# Altium schematic sheet CodeSymExample.SchDoc
size A3
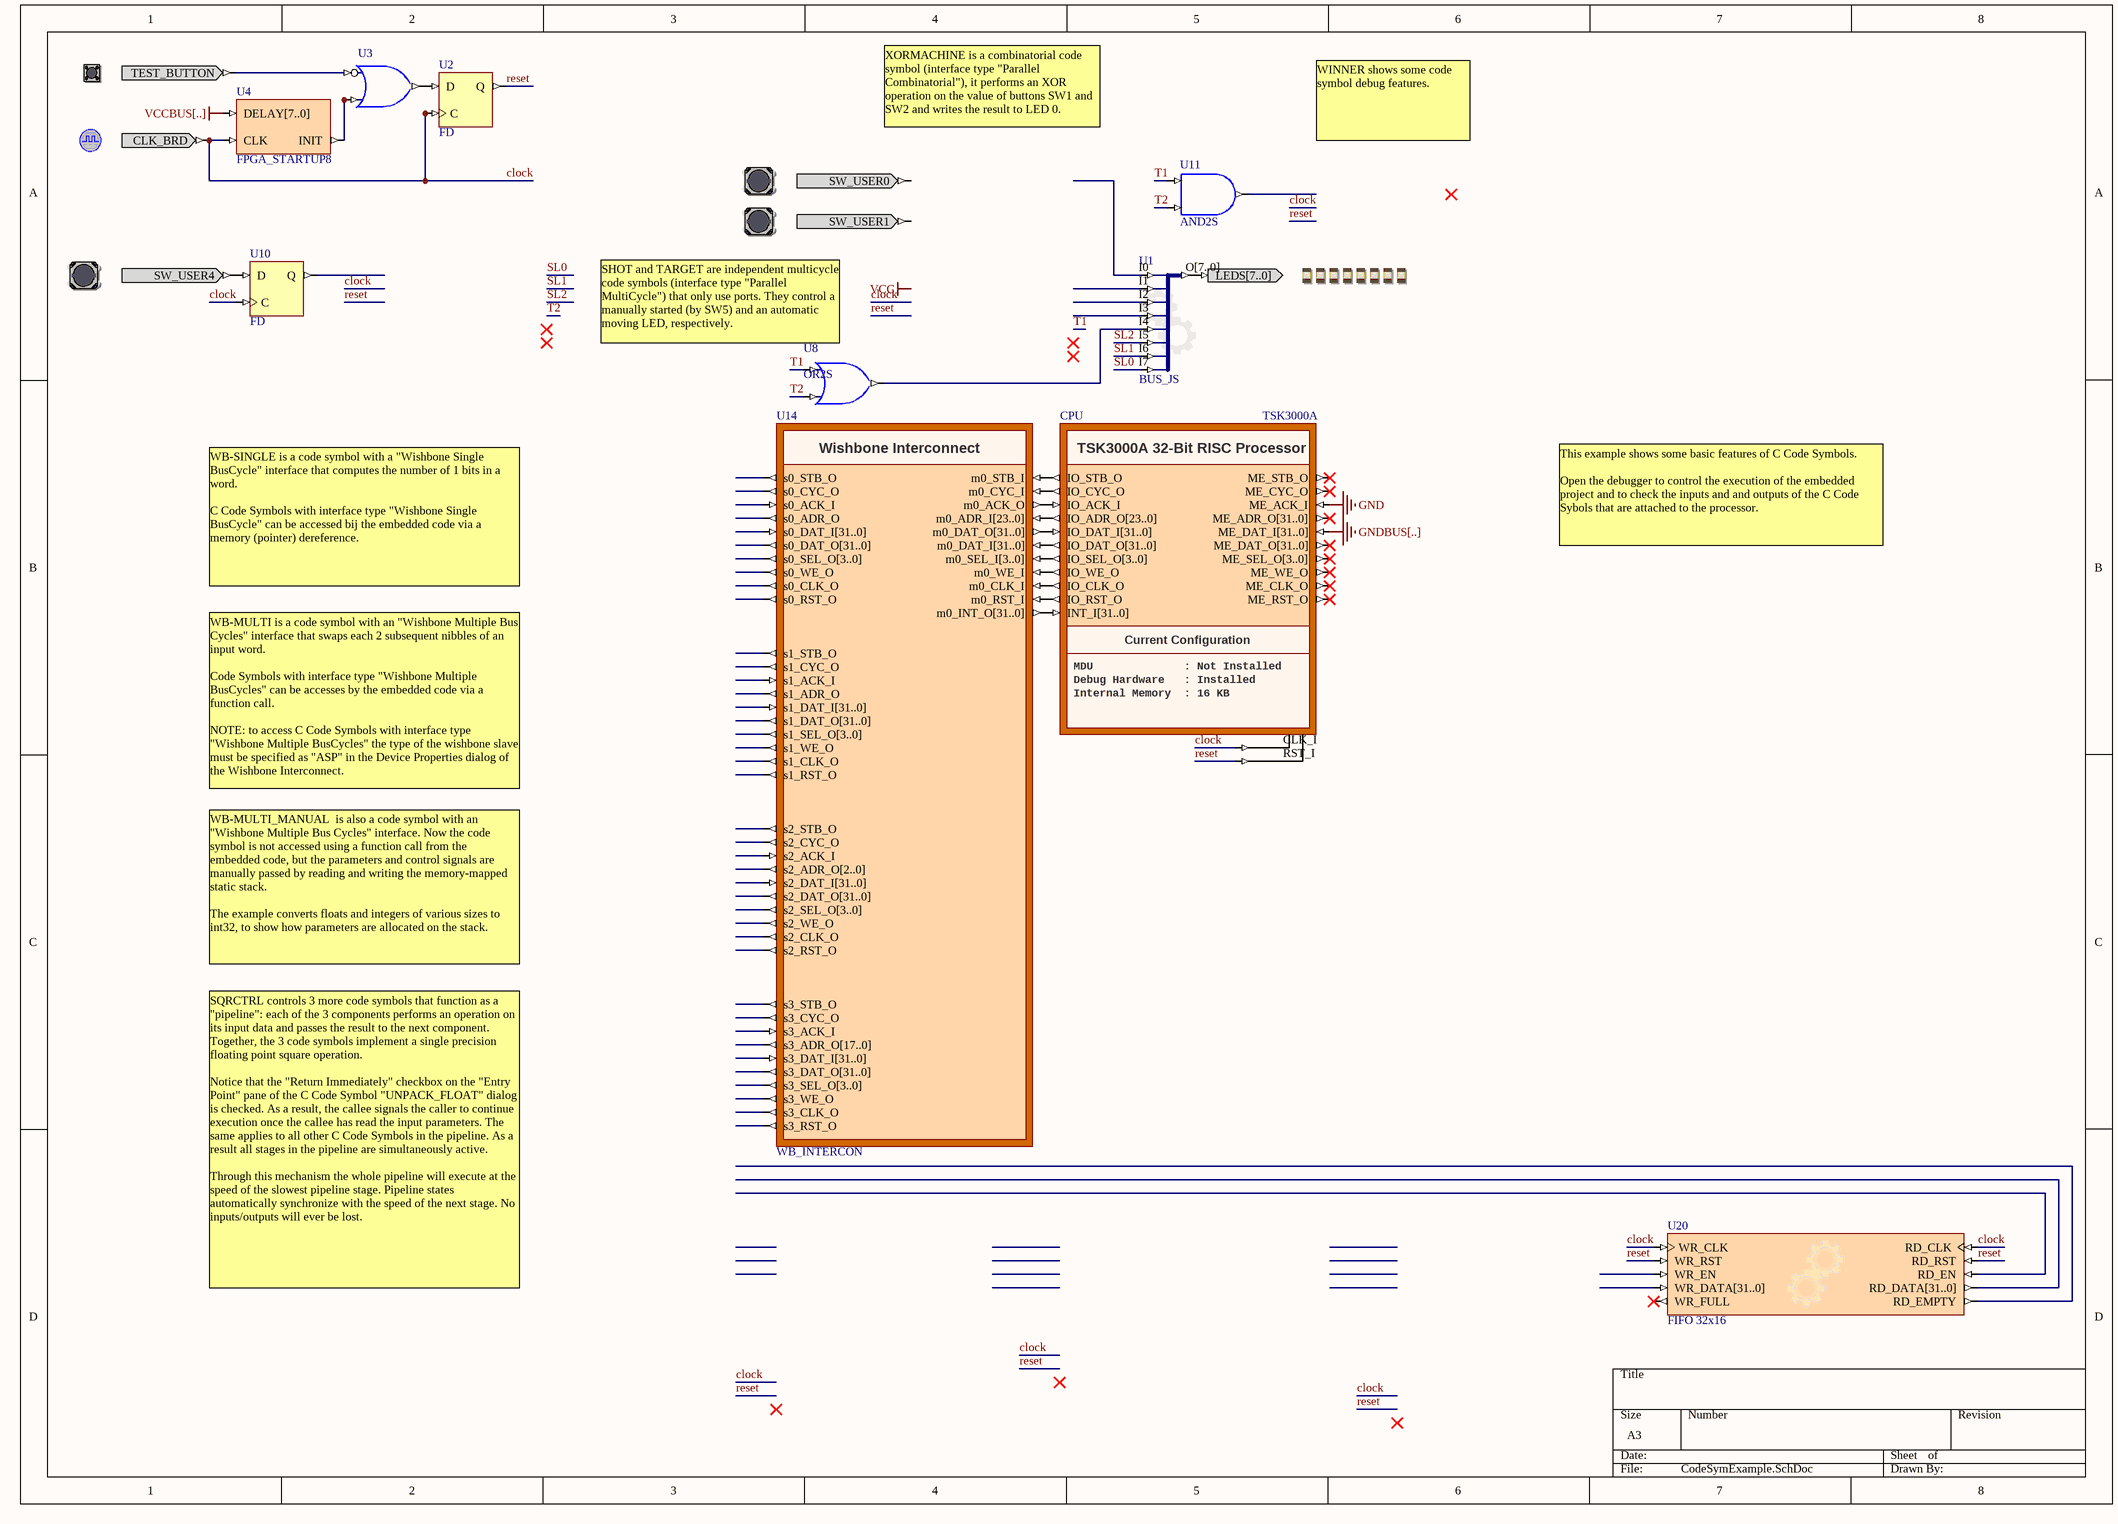
[diagram p0: CodeSymExample.SchDoc]

## Parts
(Parts that share a designator on the sheet are numbered #1, #2 ... from top to bottom, then left to right.)
?#1  TEST_BUTTON  (value not drawn)
?#2  CLOCK_BOARD  (value not drawn)
?#3  USER_BUTTON0  (value not drawn)
?#4  USER_BUTTON1  (value not drawn)
?#5  USER_BUTTON4  (value not drawn)
?#6  LED  (value not drawn)
CPU  TSK3000A
U1  BUS_JS
U2  FD
U3  OR2N1S  (value not drawn)
U4  FPGA_STARTUP8
U8  OR2S
U10  FD
U11  AND2S
U14  WB_INTERCON
U20  FIFO 32x16

## Nets
GND: CPU.ME_ACK_I
GNDBUS[..]: CPU.ME_DAT_I[31..0]
VCCBUS[..]: U4.DELAY[7..0]
clock: ?#2.CLK_BRD CPU.CLK_I U2.C U4.CLK U10.C U20.RD_CLK U20.WR_CLK
reset: CPU.RST_I U2.Q U20.RD_RST U20.WR_RST
SL0: U1.I7
SL1: U1.I6
SL2: U1.I5
T1: U8.I0 U11.I0
T2: U8.I1 U11.I1
Net?#1_TEST_BUTTON: ?#1.TEST_BUTTON U3.I0
Net?#5_SW_USER4: ?#5.SW_USER4 U10.D
Net?#6_LEDS[7..0]: ?#6.LEDS[7..0] U1.O[7..0]
NetCPU_INT_I[31..0]: CPU.INT_I[31..0] U14.m0_INT_O[31..0]
NetCPU_IO_ACK_I: CPU.IO_ACK_I U14.m0_ACK_O
NetCPU_IO_ADR_O[23..0]: CPU.IO_ADR_O[23..0] U14.m0_ADR_I[23..0]
NetCPU_IO_CLK_O: CPU.IO_CLK_O U14.m0_CLK_I
NetCPU_IO_CYC_O: CPU.IO_CYC_O U14.m0_CYC_I
NetCPU_IO_DAT_I[31..0]: CPU.IO_DAT_I[31..0] U14.m0_DAT_O[31..0]
NetCPU_IO_DAT_O[31..0]: CPU.IO_DAT_O[31..0] U14.m0_DAT_I[31..0]
NetCPU_IO_RST_O: CPU.IO_RST_O U14.m0_RST_I
NetCPU_IO_SEL_O[3..0]: CPU.IO_SEL_O[3..0] U14.m0_SEL_I[3..0]
NetCPU_IO_STB_O: CPU.IO_STB_O U14.m0_STB_I
NetCPU_IO_WE_O: CPU.IO_WE_O U14.m0_WE_I
NetU1_I4: U1.I4 U8.O
NetU2_D: U2.D U3.O
NetU3_I1: U3.I1 U4.INIT

Not connected (* = marked no-connect by the designer): ?#3 SW_USER0; ?#4 SW_USER1; CPU ME_ADR_O[31..0]* ME_CLK_O* ME_CYC_O* ME_DAT_O[31..0]* ME_RST_O* ME_SEL_O[3..0]* ME_STB_O* ME_WE_O*; U1 I0 I1 I2 I3; U10 Q; U11 O; U14 s0_ACK_I s0_ADR_O s0_CLK_O s0_CYC_O s0_DAT_I[31..0] s0_DAT_O[31..0] s0_RST_O s0_SEL_O[3..0] s0_STB_O s0_WE_O s1_ACK_I s1_ADR_O s1_CLK_O s1_CYC_O s1_DAT_I[31..0] s1_DAT_O[31..0] s1_RST_O s1_SEL_O[3..0] s1_STB_O s1_WE_O s2_ACK_I s2_ADR_O[2..0] s2_CLK_O s2_CYC_O s2_DAT_I[31..0] s2_DAT_O[31..0] s2_RST_O s2_SEL_O[3..0] s2_STB_O s2_WE_O s3_ACK_I s3_ADR_O[17..0] s3_CLK_O s3_CYC_O s3_DAT_I[31..0] s3_DAT_O[31..0] s3_RST_O s3_SEL_O[3..0] s3_STB_O s3_WE_O; U20 RD_DATA[31..0] RD_EMPTY RD_EN WR_DATA[31..0] WR_EN WR_FULL*

## Notes on the sheet
- XORMACHINE is a combinatorial code symbol (interface type "Parallel Combinatorial"), it performs an XOR operation on the value of buttons SW1 and SW2 and writes the result to LED 0.
- WINNER shows some code symbol debug features.
- (near U8) SHOT and TARGET are independent multicycle code symbols (interface type "Parallel MultiCycle") that only use ports. They control a manually started (by SW5) and an automatic moving LED, respectively.
- WB-SINGLE is a code symbol with a "Wishbone Single BusCycle" interface that computes the number of 1 bits in a word.
  C Code Symbols with interface type "Wishbone Single BusCycle" can be accessed bij the embedded code via a memory (pointer) dereference.
- This example shows some basic features of C Code Symbols.
  Open the debugger to control the execution of the embedded project and to check the inputs and and outputs of the C Code Sybols that are attached to the processor.
- WB-MULTI is a code symbol with an "Wishbone Multiple Bus Cycles" interface that swaps each 2 subsequent nibbles of an input word.
  Code Symbols with interface type "Wishbone Multiple BusCycles" can be accesses by the embedded code via a function call.
  NOTE: to access C Code Symbols with interface type "Wishbone Multiple BusCycles" the type of the wishbone slave must be specified as "ASP" in the Device Properties dialog of the Wishbone Interconnect.
- WB-MULTI_MANUAL  is also a code symbol with an "Wishbone Multiple Bus Cycles" interface. Now the code symbol is not accessed using a function call from the embedded code, but the parameters and control signals are manually passed by reading and writing the memory-mapped static stack.
  The example converts floats and integers of various sizes to int32, to show how parameters are allocated on the stack.
- SQRCTRL controls 3 more code symbols that function as a "pipeline": each of the 3 components performs an operation on its input data and passes the result to the next component. Together, the 3 code symbols implement a single precision floating point square operation.
  Notice that the "Return Immediately" checkbox on the "Entry Point" pane of the C Code Symbol "UNPACK_FLOAT" dialog is checked. As a result, the callee signals the caller to continue execution once the callee has read the input parameters. The same applies to all other C Code Symbols in the pipeline. As a result all stages in the pipeline are simultaneously active.
  Through this mechanism the whole pipeline will execute at the speed of the slowest pipeline stage. Pipeline states automatically synchronize with the speed of the next stage. No inputs/outputs will ever be lost.
- Labels drawn without touching a wire or pin: VCC
- (in symbol TSK3000A) TSK3000A 32-Bit RISC Processor; Current Configuration; MDU              : Not Installed; Debug Hardware   : Installed; Internal Memory  : 16 KB
- (in symbol WB_INTERCON) Wishbone Interconnect

## Library data of the parts
?#1 = TEST_BUTTON: Test / Reset Button; PortComponent: True; Published: 19-Nov-2003; Publisher: Altium Limited; HelpURL: https://wiki.altium.com/display/ADOH/NB2DSK01+-+Daughter+Board+Test-Reset+Button
?#2 = CLOCK_BOARD: Global System Clock Supply; PortComponent: True; Published: 19-Nov-2003; Publisher: Altium Limited; HelpURL: https://wiki.altium.com/display/ADOH/NB2DSK01+-+System+Clocks; UseInDSF: True
?#3 = USER_BUTTON0: Generic User Button; PortComponent: True; Published: 16-Apr-2007; Publisher: Altium Limited; HelpURL: https://wiki.altium.com/display/ADOH/NB2DSK01+-+Generic+User+Switches
?#4 = USER_BUTTON1: Generic User Button; PortComponent: True; Published: 16-Apr-2007; Publisher: Altium Limited; HelpURL: https://wiki.altium.com/display/ADOH/NB2DSK01+-+Generic+User+Switches
?#5 = USER_BUTTON4: Generic User Button; PortComponent: True; Published: 16-Apr-2007; Publisher: Altium Limited; HelpURL: https://wiki.altium.com/display/ADOH/NB2DSK01+-+Generic+User+Switches
?#6 = LED: Bank of eight Red LEDs; PortComponent: True; Published: 19-Nov-2003; Publisher: Altium Limited; HelpURL: https://wiki.altium.com/display/ADOH/NB2DSK01+-+User+LEDs
CPU = TSK3000A: TSK3000A OCD Microprocessor; Nexus_JTAG_Device: True; Nexus_Core: Processor_OCDS; Nexus_JTAG_Order: 0; ConfigurationParameters: {}Version[1.0]{}Option_Processor[0]{}Option_Memory[4]{}Option_MDU[1]{}Option_OCDS[0]{}Option_Shifter[0]{}Option_InterruptCount[32]{}Option_DebugWhenReset[0]{}; ConfiguratorName: FPGA_MCU32; Memory_Configuration: Record[AUTOIMPORT]{}AutoImport_Peripherals[False]{n}Record[CODE_EXPORT]{}ExportType[1]{n}Record[PERIPHERAL]{}ComponentDesignator[sqrctrl]{}Memory_Depth[0x40000]{}Memory_UsageType[peripheral]{}Memory_Speed[1]{}ProgramDownloadAddress[0xFF400000]{}Memory_BusType[TSK3000:addr_bus]{}Memory_Mau[8]{}Memory_MatchedComponent[]{}Memory_Description[U14]{}Memory_FillBitPattern[]{}Memory_IncludeDependencies[False]{}Memory_ByLoadAddress[False]{}Memory_CopyDuringInit[False]{}Memory_NoCopyDuringInit[False]{}Memory_Interrupts[]{n}Record[PERIPHERAL]{}ComponentDesignator[wb_multi]{}Memory_Depth[0x0010]{}Memory_UsageType[asp]{}Memory_Speed[1]{}ProgramDownloadAddress[0xFF200000]{}Memory_BusType[TSK3000:addr_bus]{}Memory_Mau[8]{}Memory_MatchedComponent[]{}Memory_Description[U14]{}Memory_FillBitPattern[]{}Memory_IncludeDependencies[False]{}Memory_ByLoadAddress[False]{}Memory_CopyDuringInit[False]{}Memory_NoCopyDuringInit[False]{}Memory_Interrupts[]{n}Record[PERIPHERAL]{}ComponentDesignator[wb_multi_manual]{}Memory_Depth[0x0010]{}Memory_UsageType[peripheral]{}Memory_Speed[1]{}ProgramDownloadAddress[0xFF300000]{}Memory_BusType[TSK3000:addr_bus]{}Memory_Mau[8]{}Memory_MatchedComponent[]{}Memory_Description[U14]{}Memory_FillBitPattern[]{}Memory_IncludeDependencies[False]{}Memory_ByLoadAddress[False]{}Memory_CopyDuringInit[False]{}Memory_NoCopyDuringInit[False]{}Memory_Interrupts[]{n}Record[PERIPHERAL]{}ComponentDesignator[wb_single]{}Memory_Depth[0x0002]{}Memory_UsageType[peripheral]{}Memory_Speed[1]{}ProgramDownloadAddress[0xFF100000]{}Memory_BusType[TSK3000:addr_bus]{}Memory_Mau[8]{}Memory_MatchedComponent[]{}Memory_Description[U14]{}Memory_FillBitPattern[]{}Memory_IncludeDependencies[False]{}Memory_ByLoadAddress[False]{}Memory_CopyDuringInit[False]{}Memory_NoCopyDuringInit[False]{}Memory_Interrupts[]{n}; ChildModel1: TSK3000A_MCU; ChildModel2: TSK3000A_MDU; ChildModel3: TSK3000A_OCDS; ChildModel4: TSK3000A_Shift_Barrel; ChildModel5: TSK3000A_Shift_Sequential; ChildModel6: Mult_32x32; ChildModel7: m33x33; ProgramLogicalTopAddress: 0; ComponentLink1Description: Core &Resource Usage; ComponentLink1URL: CR0140 FPGA Processor Resource Usage.pdf#page=22; HelpURL: https://wiki.altium.com/display/ADOH/TSK3000A; LastRevisionNo: 1.00.00; Published: 17-Nov-2004; Publisher: Altium Limited; ComponentLink2Description: Embedded &Tools Guide; ComponentLink2URL: https://wiki.altium.com/download/attachments/3080675/GU0111+Using+the+TSK3000+Embedded+Tools.pdf?version=1; ComponentLink3Description: Embedded T&echnical References; ComponentLink3URL: https://wiki.altium.com/download/attachments/3080675/TR0109+TSK3000+Embedded+Tools+Reference.pdf?version=1
U1 = BUS_JS: Configurable Bus Joiner/Splitter; ConfiguratorName: GENERIC_BUS_JS; ConfigurationParameters: {}Version[1.1]{}SplitterJoinerType[Joiner]{}SignalCount[8]{}SignalWidth0[1]{}GapBelow0[1000000]{}ConnectionType0[Pin]{}SignalWidth1[1]{}GapBelow1[1000000]{}ConnectionType1[Pin]{}SignalWidth2[1]{}GapBelow2[1000000]{}ConnectionType2[Pin]{}SignalWidth3[1]{}GapBelow3[1000000]{}ConnectionType3[Pin]{}SignalWidth4[1]{}GapBelow4[1000000]{}ConnectionType4[Pin]{}SignalWidth5[1]{}GapBelow5[1000000]{}ConnectionType5[Pin]{}SignalWidth6[1]{}GapBelow6[1000000]{}ConnectionType6[Pin]{}SignalWidth7[1]{}GapBelow7[1000000]{}ConnectionType7[Pin]{}ShowPinNames[True]{}; LastRevisionNo: 1.00.00; Published: 17-Sep-2008; Publisher: Altium Limited; HelpURL: https://wiki.altium.com/display/ADOH/Configurable+Generic+Library
U2 U10 = FD: D-Type Flip-Flop; ClockTrigger: Rising; ArchiveName: GENERIC; VHDLIB_SIM: GENERIC_LIB; Published: 29-Jan-2004; Publisher: Altium Limited; XilinxEquivalent: FD; LastRevisionNo: 1.00.00; HelpURL: CR0118 FPGA Generic Library Guide.pdf#page=170; ComponentLink1URL: CR0133 FPGA Flip Flop Resource Usage.pdf#page=4; ComponentLink1Description: Core &Resource Usage; FunctionalClass: Flip-Flop; SubClass: FD
U3 = OR2N1S: 2-Input OR Gate with Active Low A Input, Single Pin Version; XilinxEquivalent: OR2B1; FunctionalClass: Logic Primitive; PortSize: 2; ArchiveName: GENERIC; VHDLIB_SIM: GENERIC_LIB; Published: 29-Jan-2004; Publisher: Altium Limited; LastRevisionNo: 1.00.00; HelpURL: CR0118 FPGA Generic Library Guide.pdf#page=410; ComponentLink1URL: CR0136 FPGA Logic Primitive Resource Usage.pdf#page=187; ComponentLink1Description: Core &Resource Usage; SubClass: OR; PortStyle: Single Pin Version
U4 = FPGA_STARTUP8: FPGA Startup With 8 Bit Delay; Published: 9-Dec-2004; Publisher: Altium Limited; HelpURL: CR0119 FPGA_STARTUPx Powerup Delay Unit.pdf; LastRevisionNo: 1.00.00; ComponentLink1Description: Core &Resource Usage; ComponentLink1URL: CR0139 FPGA Peripheral Resource Usage.pdf#page=11
U8 = OR2S: 2-Input OR Gate, Single Pin Version; XilinxEquivalent: OR2; FunctionalClass: Logic Primitive; PortSize: 2; ArchiveName: GENERIC; VHDLIB_SIM: GENERIC_LIB; Published: 29-Jan-2004; Publisher: Altium Limited; LastRevisionNo: 1.00.00; HelpURL: CR0118 FPGA Generic Library Guide.pdf#page=410; ComponentLink1URL: CR0136 FPGA Logic Primitive Resource Usage.pdf#page=190; ComponentLink1Description: Core &Resource Usage; SubClass: OR; PortStyle: Single Pin Version
U11 = AND2S: 2-Input AND Gate, Single Pin Version; XilinxEquivalent: AND2; FunctionalClass: Logic Primitive; PortSize: 2; ArchiveName: GENERIC; VHDLIB_SIM: GENERIC_LIB; Published: 29-Jan-2004; Publisher: Altium Limited; LastRevisionNo: 1.00.00; HelpURL: CR0118 FPGA Generic Library Guide.pdf#page=114; ComponentLink1URL: CR0136 FPGA Logic Primitive Resource Usage.pdf#page=13; ComponentLink1Description: Core &Resource Usage; SubClass: AND; PortStyle: Single Pin Version
U14 = WB_INTERCON: Configurable Wishbone Interconnect; ConfigurationParameters: {}Version[1.0]{}UnusedInterrupts[1]{}MasterAddressBits[1]{}Name0[wb_single]{}Kind0[0]{}SpaceAfter0[3]{}Address_Base0[1048576]{}Address_Bits0[1]{}Address_Mode0[0]{}Address_DecodeWidth0[8]{}DataWidth0[0]{}UsedInterrupts0[ ]{}Name1[wb_multi]{}Kind1[4]{}SpaceAfter1[3]{}Address_Base1[2097152]{}Address_Bits1[1]{}Address_Mode1[0]{}Address_DecodeWidth1[8]{}DataWidth1[0]{}UsedInterrupts1[ ]{}Name2[wb_multi_manual]{}Kind2[0]{}SpaceAfter2[3]{}Address_Base2[3145728]{}Address_Bits2[3]{}Address_Mode2[0]{}Address_DecodeWidth2[8]{}DataWidth2[0]{}UsedInterrupts2[ ]{}Name3[sqrctrl]{}Kind3[0]{}SpaceAfter3[4]{}Address_Base3[4194304]{}Address_Bits3[18]{}Address_Mode3[0]{}Address_DecodeWidth3[8]{}DataWidth3[0]{}UsedInterrupts3[ ]; ComponentLink1Description: Core &Resource Usage; ComponentLink1URL: CR0139 FPGA Peripheral Resource Usage.pdf#page=78; HelpURL: https://wiki.altium.com/display/ADOH/WB_INTERCON+-+Configurable+Wishbone+Interconnect; LastRevisionNo: 1.00.00; Published: 9-Dec-2004; Publisher: Altium Limited; ConfiguratorName: WB_INTERCON
U20 = FIFO: Configurable Generic FIFO; ConfiguratorName: GENERIC_FIFO; ConfigurationParameters: {}Version[1.0]{}Option_FifoKind[2]{}Option_FifoDepth[0]{}Option_FifoWidth[32]{}Option_PortsSameClock[True]{}Option_RisingEdgeClock[True]{}Option_UseDistributed[False]{}Option_Write_FullFlag[True]{}Option_Write_AlmostFullFlag[False]{}Option_Write_AlmostFullValue[1]{}Option_Write_FreeSlots[False]{}Option_Read_EmptyFlag[True]{}Option_Read_AlmostEmptyFlag[False]{}Option_Read_AlmostEmptyValue[1]{}Option_Read_DataCount[False]{}; LastRevisionNo: 1.00.00; Published: 17-Sep-2008; Publisher: Altium Limited; HelpURL: https://wiki.altium.com/display/ADOH/Configurable+Generic+Library